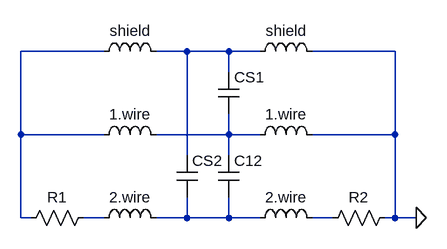
[diagram p0: schematic sch_K.asc]
sch_K.asc, the LTspice schematic file:
Version 4
SHEET 1 880 680
WIRE -160 -96 -288 -96
WIRE -32 -96 -80 -96
WIRE 32 -96 -32 -96
WIRE 80 -96 32 -96
WIRE 288 -96 160 -96
WIRE 32 -64 32 -96
WIRE -288 32 -288 -96
WIRE -160 32 -288 32
WIRE 32 32 32 0
WIRE 32 32 -80 32
WIRE 80 32 32 32
WIRE 288 32 288 -96
WIRE 288 32 160 32
WIRE -32 64 -32 -96
WIRE 32 64 32 32
WIRE -288 160 -288 32
WIRE -272 160 -288 160
WIRE -160 160 -192 160
WIRE -32 160 -32 128
WIRE -32 160 -80 160
WIRE 32 160 32 128
WIRE 32 160 -32 160
WIRE 80 160 32 160
WIRE 192 160 160 160
WIRE 288 160 288 32
WIRE 288 160 272 160
WIRE 320 160 288 160
FLAG 320 160 0
SYMBOL cap 16 64 R0
SYMATTR InstName C12
SYMATTR Value ""
SYMBOL ind -176 48 R270
WINDOW 0 32 56 VTop 2
WINDOW 3 5 56 VBottom 2
SYMATTR InstName 1.wire
SYMATTR Value ""
SYMBOL res -176 144 R90
WINDOW 0 0 56 VBottom 2
WINDOW 3 32 56 VTop 2
SYMATTR InstName R1
SYMATTR Value ""
SYMBOL ind 64 48 R270
WINDOW 0 32 56 VTop 2
WINDOW 3 5 56 VBottom 2
SYMATTR InstName 1.wire
SYMATTR Value ""
SYMBOL ind -176 176 R270
WINDOW 0 32 56 VTop 2
WINDOW 3 5 56 VBottom 2
SYMATTR InstName 2.wire
SYMATTR Value ""
SYMBOL ind 64 176 R270
WINDOW 0 32 56 VTop 2
WINDOW 3 5 56 VBottom 2
SYMATTR InstName 2.wire
SYMATTR Value ""
SYMBOL res 288 144 R90
WINDOW 0 0 56 VBottom 2
WINDOW 3 32 56 VTop 2
SYMATTR InstName R2
SYMATTR Value ""
SYMBOL ind -176 -80 R270
WINDOW 0 32 56 VTop 2
WINDOW 3 5 56 VBottom 2
SYMATTR InstName shield
SYMATTR Value ""
SYMBOL ind 64 -80 R270
WINDOW 0 32 56 VTop 2
WINDOW 3 5 56 VBottom 2
SYMATTR InstName shield
SYMATTR Value ""
SYMBOL cap 16 -64 R0
SYMATTR InstName CS1
SYMATTR Value ""
SYMBOL cap -48 64 R0
SYMATTR InstName CS2
SYMATTR Value ""

The netlist it stands for:
* sch_K.asc
C12 N003 N005
L§1.wire N001 N003
R1 N004 N001
L§1.wire N003 0
L§2.wire N004 N005
L§2.wire N005 N006
R2 0 N006
L§shield N001 N002
L§shield N002 0
CS1 N002 N003
CS2 N002 N005
.backanno
.end